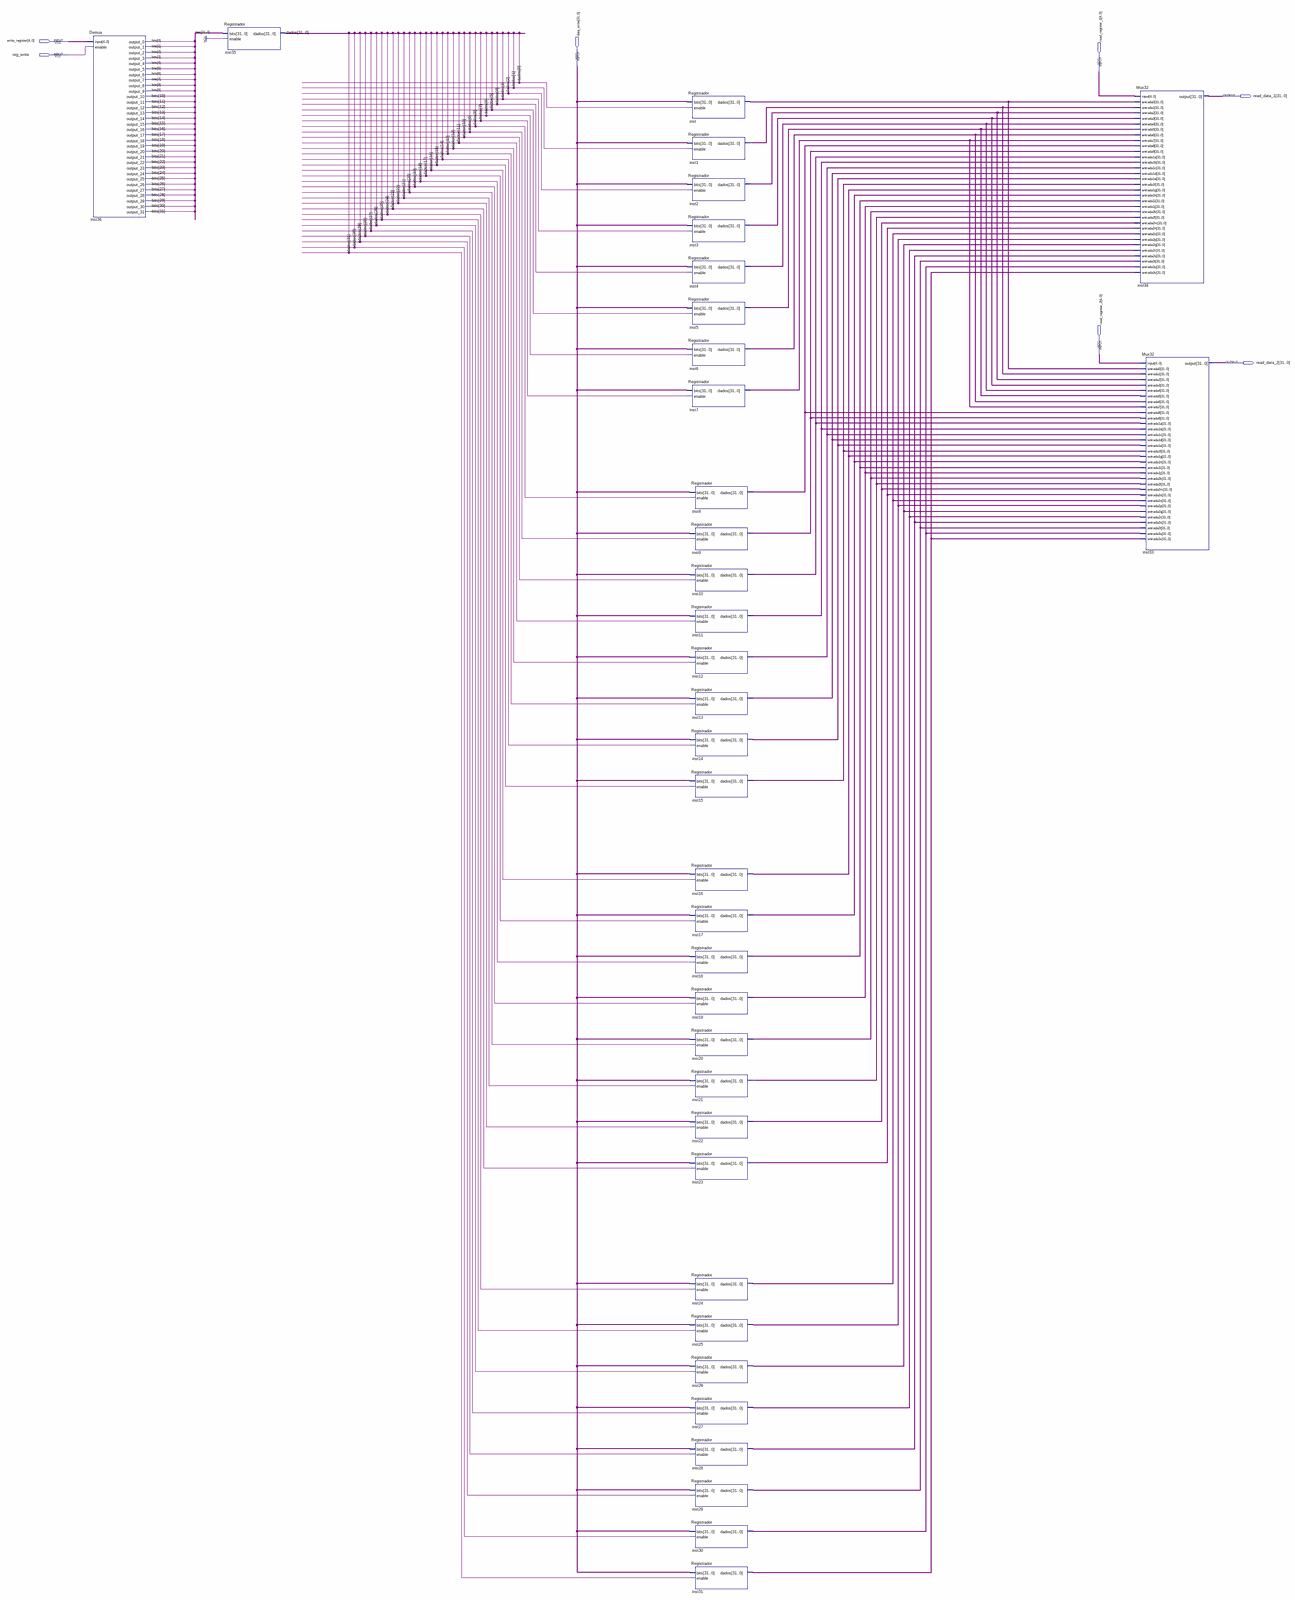
[diagram p0: schematic sheet, whole]
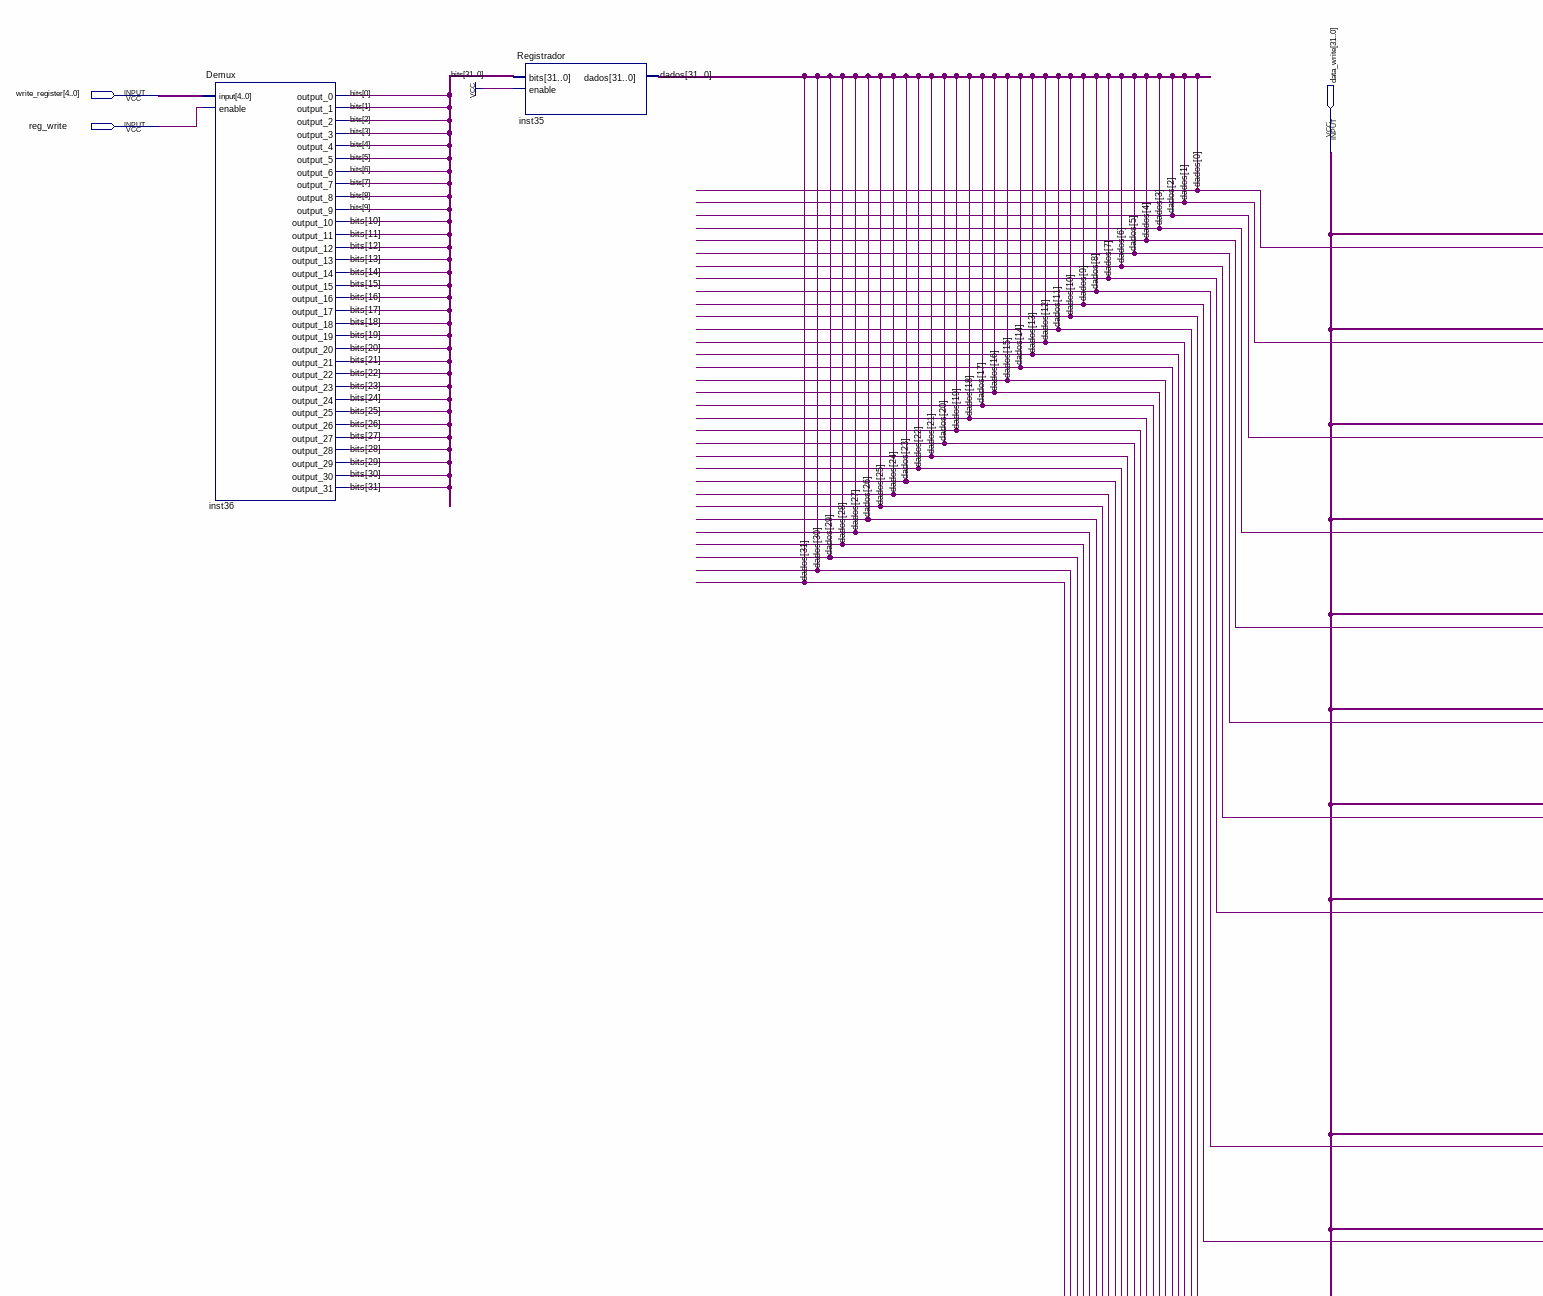
[diagram p1: schematic sheet, upper left part]
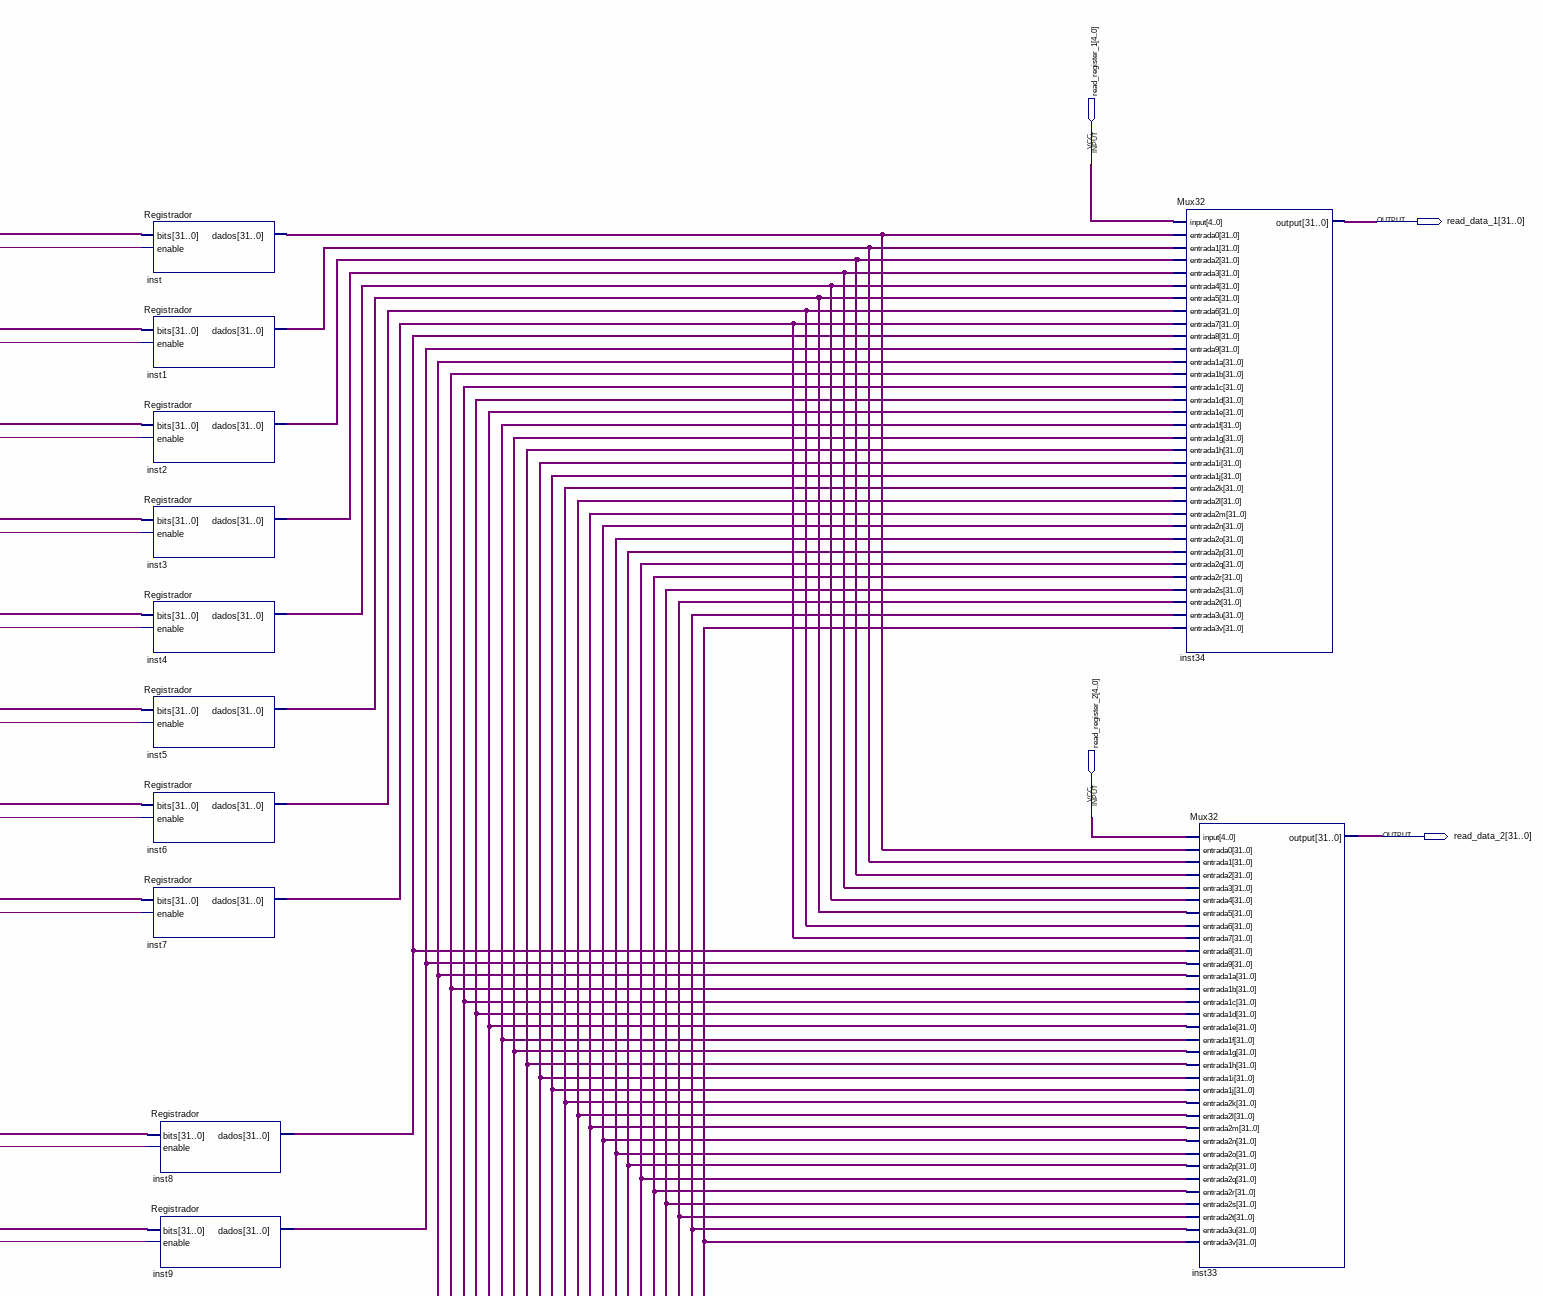
[diagram p2: schematic sheet, upper right part]
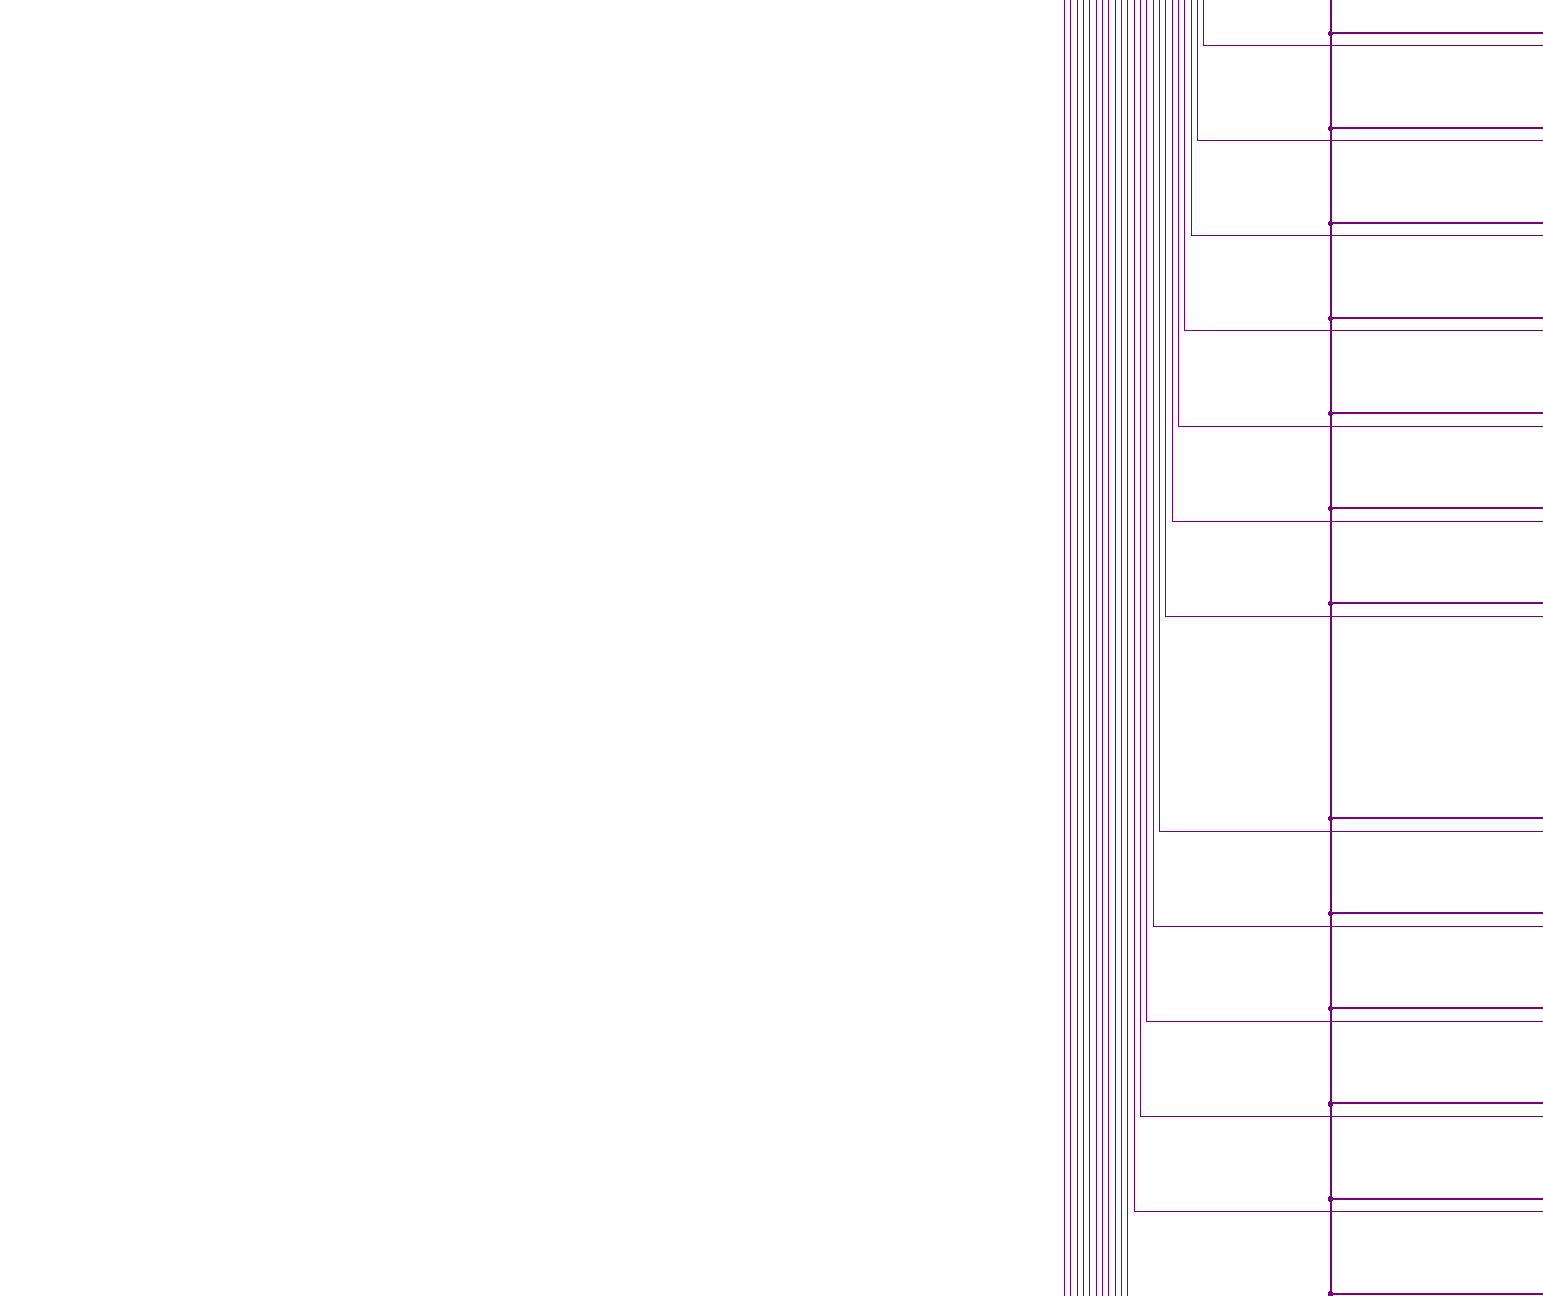
[diagram p3: schematic sheet, middle left part]
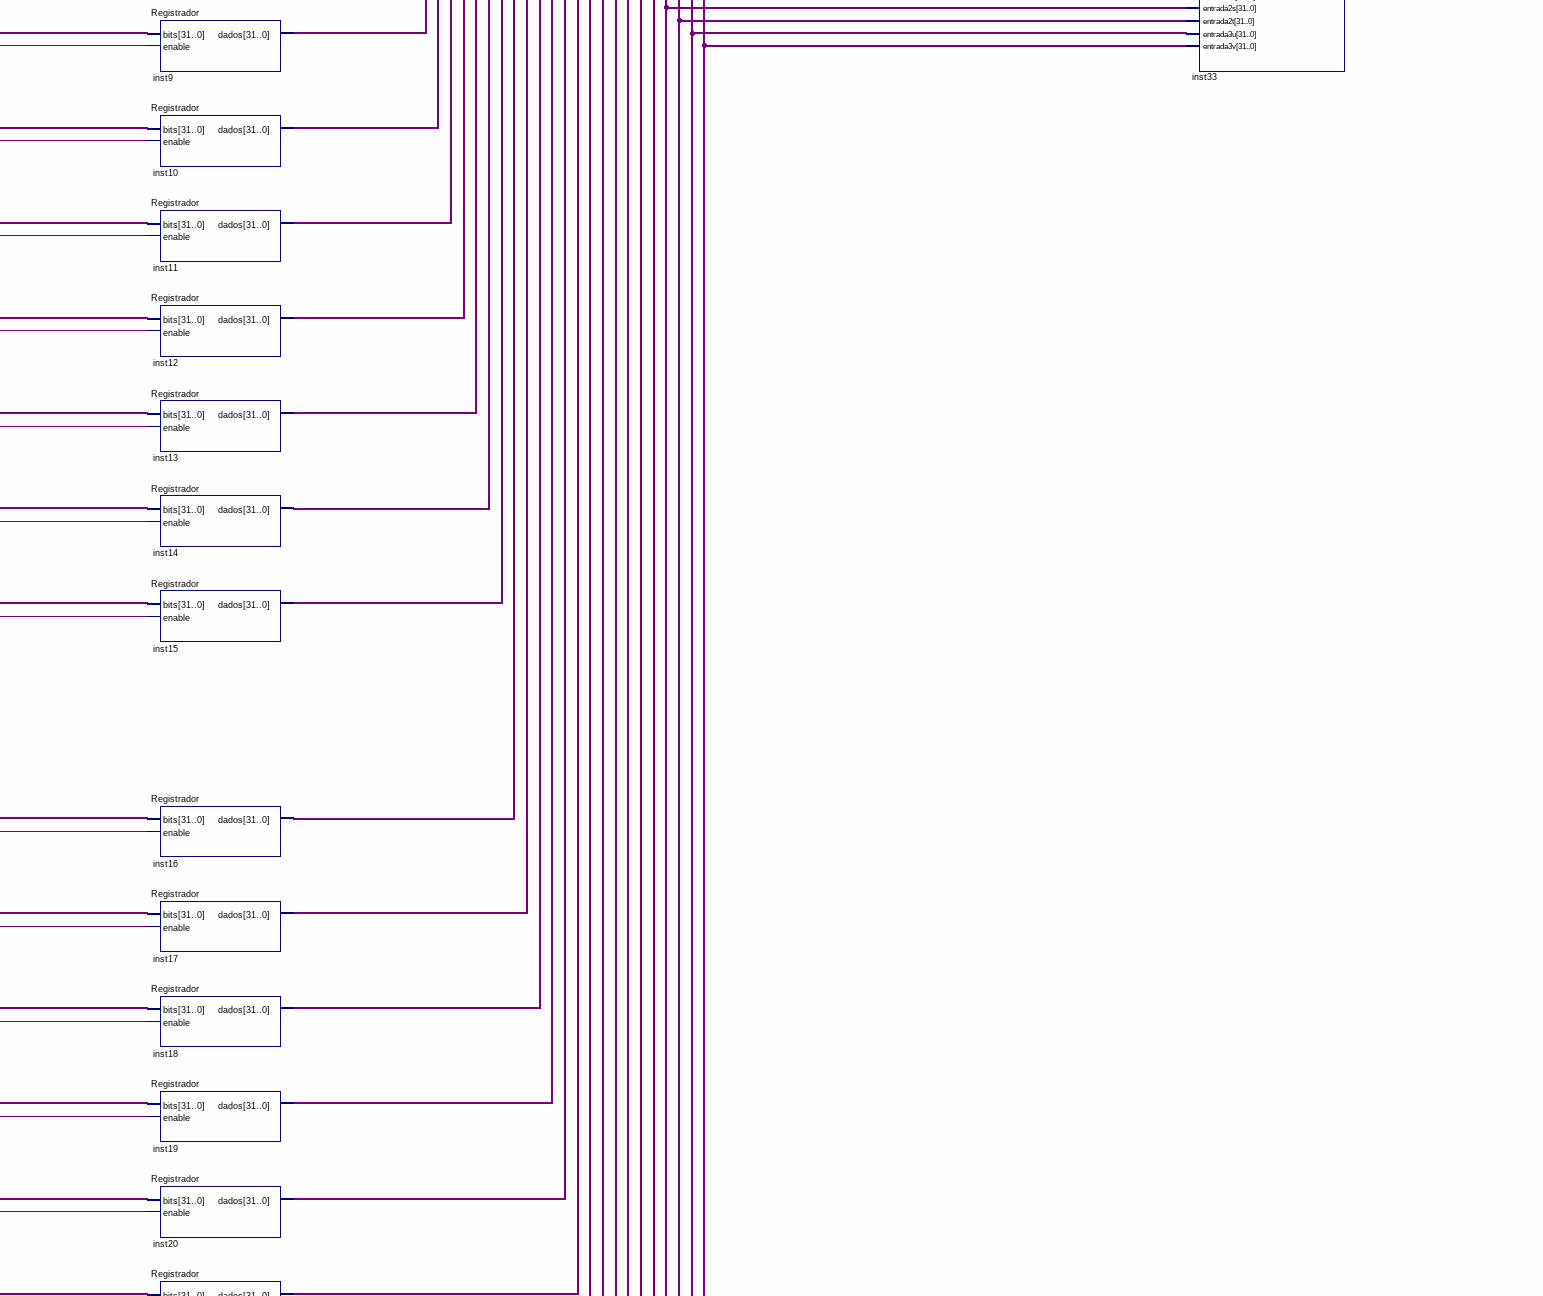
[diagram p4: schematic sheet, middle right part]
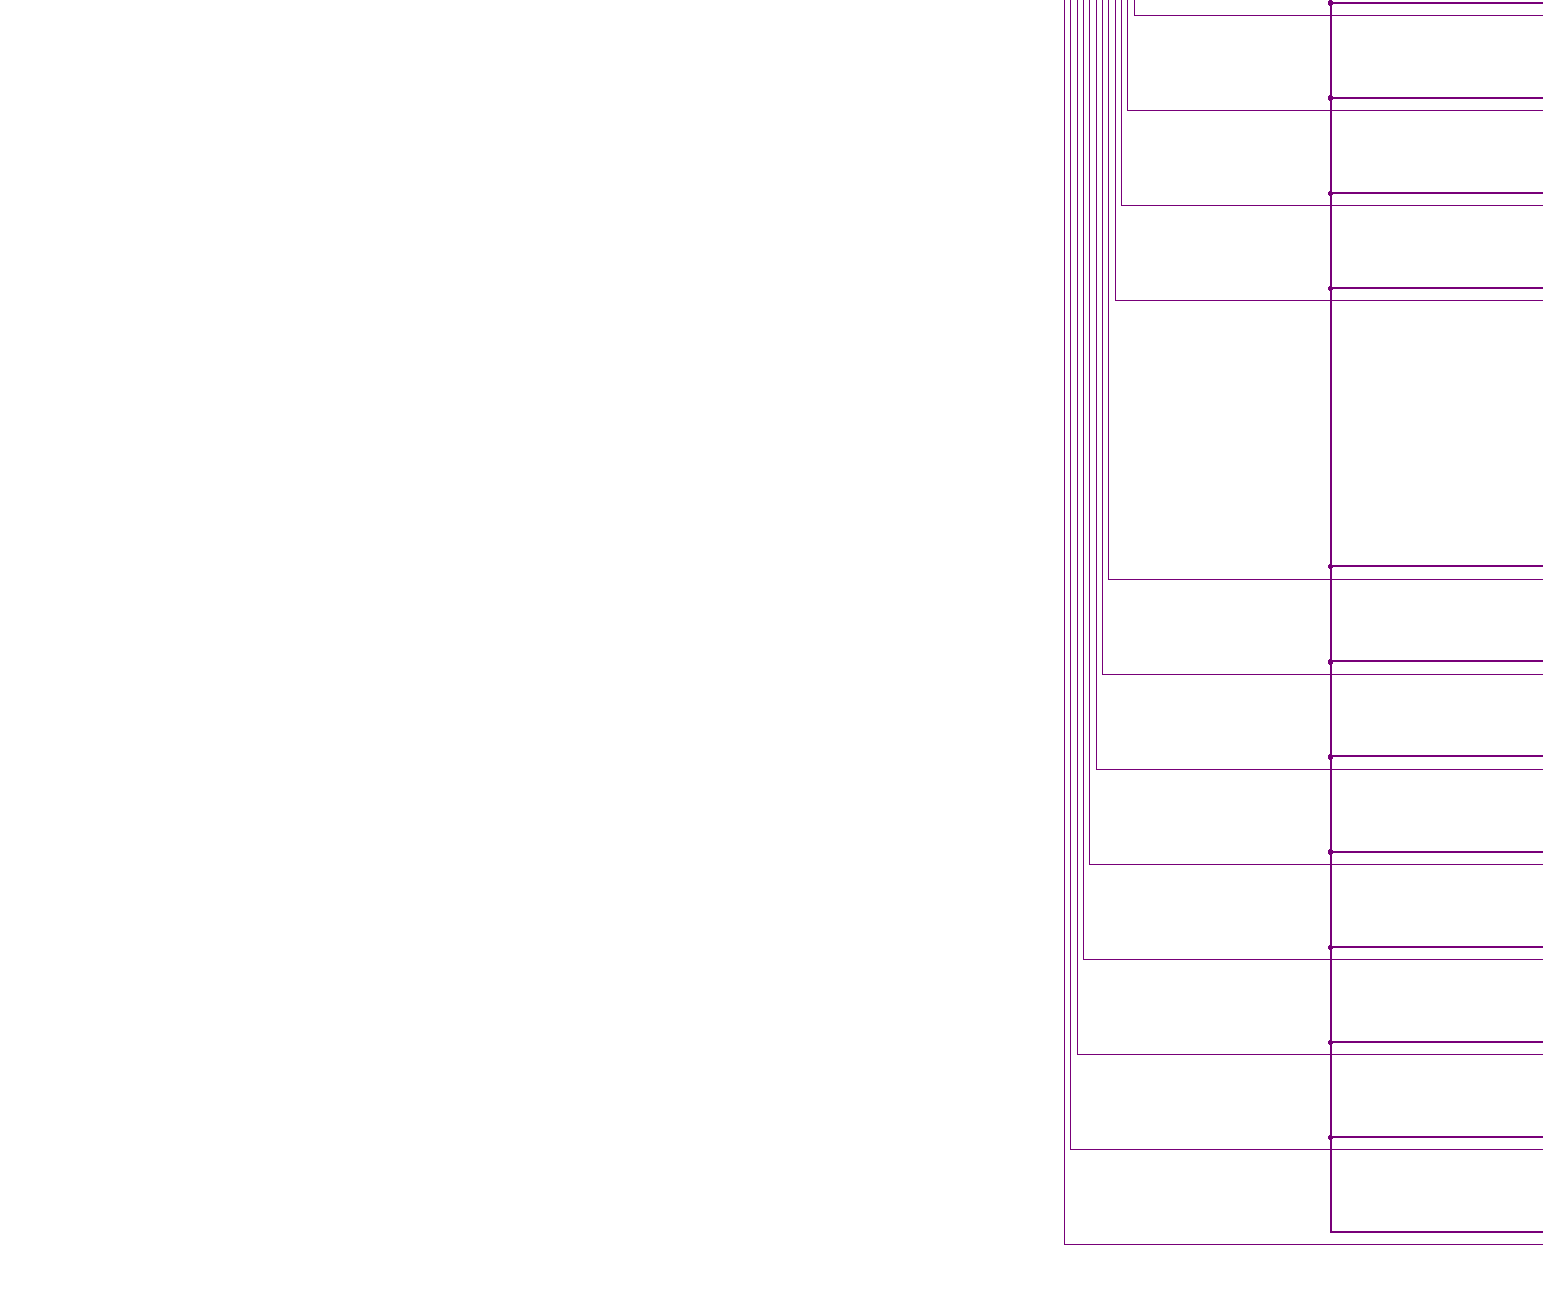
[diagram p5: schematic sheet, lower left part]
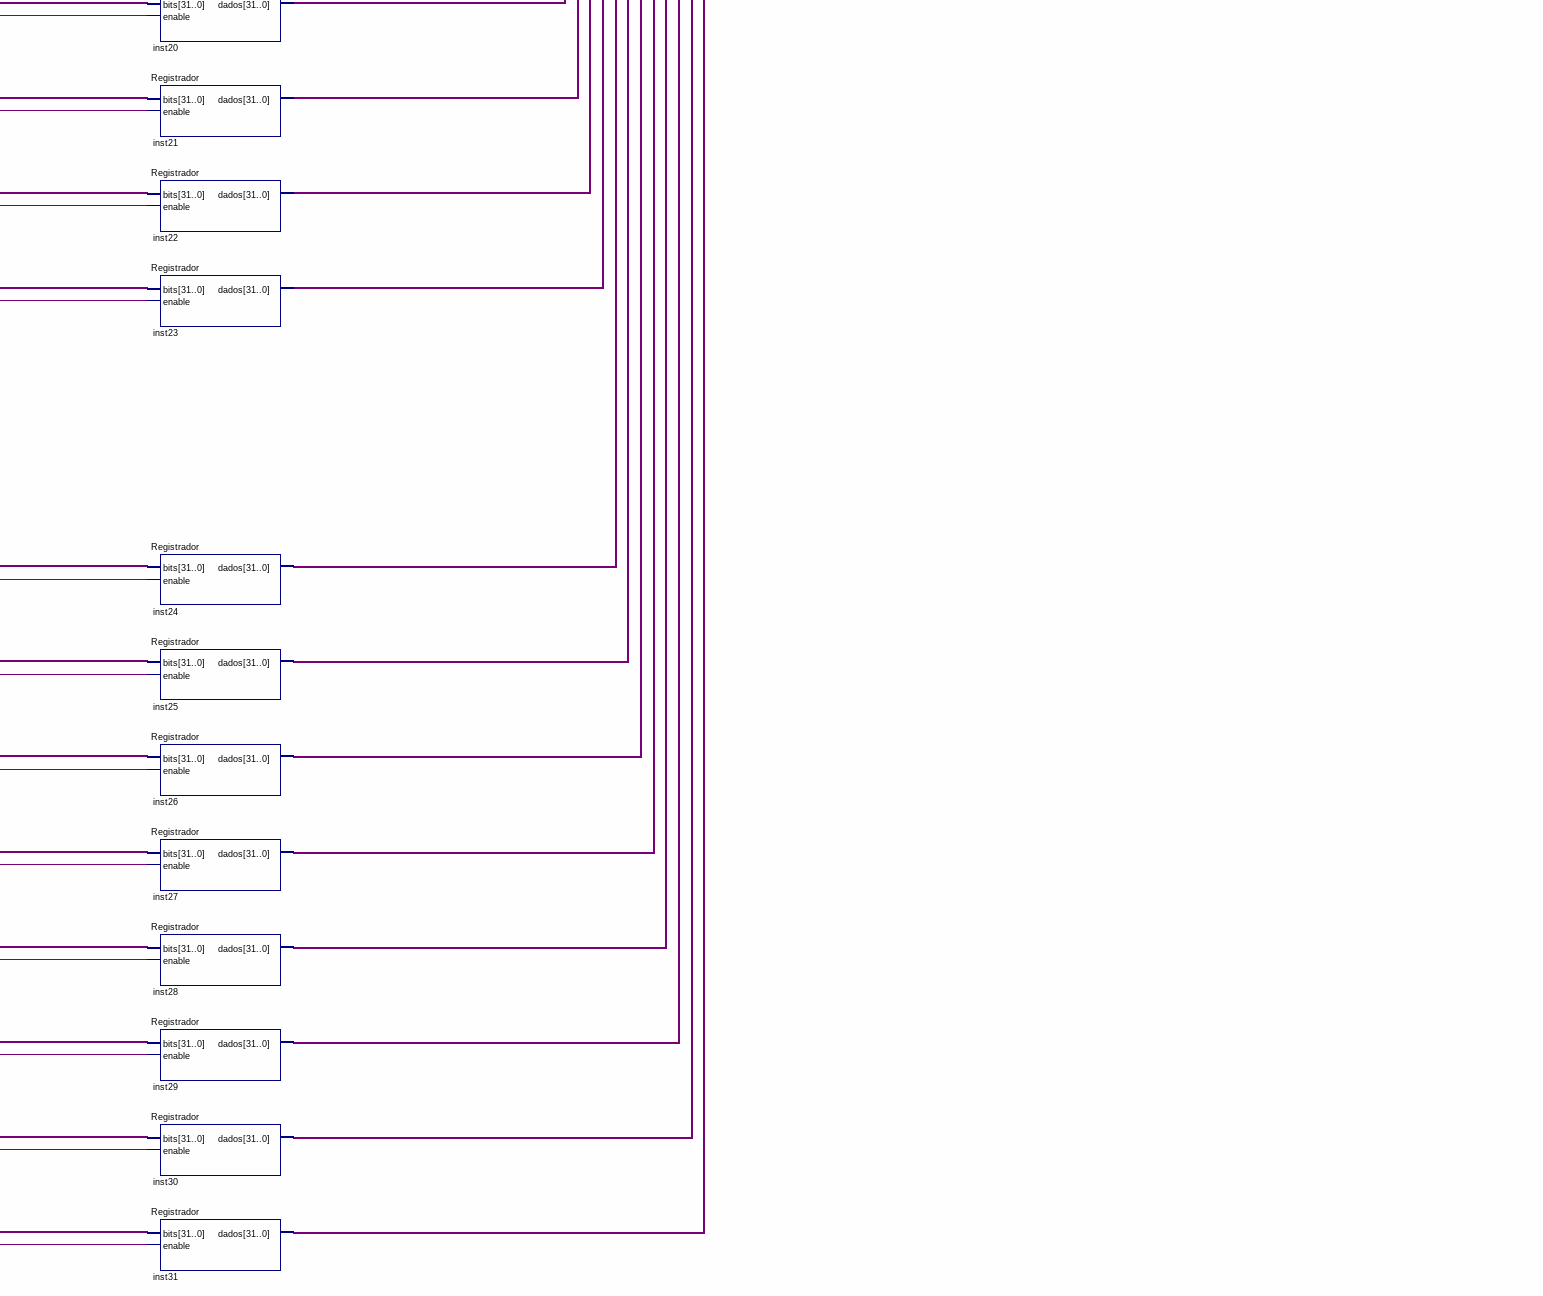
[diagram p6: schematic sheet, lower right part]
// Quartus schematic BancoRegistrador.bdf as structural Verilog: 36 symbols, 7 pins
module BancoRegistrador (
  input  [4:0] write_register,
  input  reg_write,
  input  [31:0] data_write,
  input  [4:0] read_register_1,
  input  [4:0] read_register_2,
  output [31:0] read_data_1,
  output [31:0] read_data_2
);

  wire [31:0] bits, dados, inst1_dados, inst2_dados, inst3_dados, inst4_dados, inst5_dados, inst6_dados,
       inst7_dados, inst8_dados, inst9_dados, inst10_dados, inst11_dados, inst12_dados, inst13_dados,
       inst14_dados, inst15_dados, inst16_dados, inst17_dados, inst18_dados, inst19_dados, inst20_dados,
       inst21_dados, inst22_dados, inst23_dados, inst24_dados, inst25_dados, inst26_dados, inst27_dados,
       inst28_dados, inst29_dados, inst30_dados, inst31_dados, inst_dados;

  Demux inst36 (
    .\input (write_register), .enable(reg_write), .output_0(bits[0]), .output_1(bits[1]), .output_2(bits[2]),
    .output_3(bits[3]), .output_4(bits[4]), .output_5(bits[5]), .output_6(bits[6]), .output_7(bits[7]),
    .output_8(bits[8]), .output_9(bits[9]), .output_10(bits[10]), .output_11(bits[11]), .output_12(bits[12]),
    .output_13(bits[13]), .output_14(bits[14]), .output_15(bits[15]), .output_16(bits[16]),
    .output_17(bits[17]), .output_18(bits[18]), .output_19(bits[19]), .output_20(bits[20]),
    .output_21(bits[21]), .output_22(bits[22]), .output_23(bits[23]), .output_24(bits[24]),
    .output_25(bits[25]), .output_26(bits[26]), .output_27(bits[27]), .output_28(bits[28]),
    .output_29(bits[29]), .output_30(bits[30]), .output_31(bits[31]));
  Registrador inst35 (.bits(bits), .enable(1'b1), .dados(dados));
  Registrador inst (.bits(data_write), .enable(dados[0]), .dados(inst_dados));
  Registrador inst1 (.bits(data_write), .enable(dados[1]), .dados(inst1_dados));
  Registrador inst2 (.bits(data_write), .enable(dados[2]), .dados(inst2_dados));
  Registrador inst3 (.bits(data_write), .enable(dados[3]), .dados(inst3_dados));
  Registrador inst4 (.bits(data_write), .enable(dados[4]), .dados(inst4_dados));
  Registrador inst5 (.bits(data_write), .enable(dados[5]), .dados(inst5_dados));
  Registrador inst6 (.bits(data_write), .enable(dados[6]), .dados(inst6_dados));
  Registrador inst7 (.bits(data_write), .enable(dados[7]), .dados(inst7_dados));
  Registrador inst8 (.bits(data_write), .enable(dados[8]), .dados(inst8_dados));
  Registrador inst9 (.bits(data_write), .enable(dados[9]), .dados(inst9_dados));
  Registrador inst10 (.bits(data_write), .enable(dados[10]), .dados(inst10_dados));
  Registrador inst11 (.bits(data_write), .enable(dados[11]), .dados(inst11_dados));
  Registrador inst12 (.bits(data_write), .enable(dados[12]), .dados(inst12_dados));
  Registrador inst13 (.bits(data_write), .enable(dados[13]), .dados(inst13_dados));
  Registrador inst14 (.bits(data_write), .enable(dados[14]), .dados(inst14_dados));
  Registrador inst15 (.bits(data_write), .enable(dados[15]), .dados(inst15_dados));
  Registrador inst16 (.bits(data_write), .enable(dados[16]), .dados(inst16_dados));
  Registrador inst17 (.bits(data_write), .enable(dados[17]), .dados(inst17_dados));
  Registrador inst18 (.bits(data_write), .enable(dados[18]), .dados(inst18_dados));
  Registrador inst19 (.bits(data_write), .enable(dados[19]), .dados(inst19_dados));
  Registrador inst20 (.bits(data_write), .enable(dados[20]), .dados(inst20_dados));
  Registrador inst21 (.bits(data_write), .enable(dados[21]), .dados(inst21_dados));
  Registrador inst22 (.bits(data_write), .enable(dados[22]), .dados(inst22_dados));
  Registrador inst23 (.bits(data_write), .enable(dados[23]), .dados(inst23_dados));
  Registrador inst24 (.bits(data_write), .enable(dados[24]), .dados(inst24_dados));
  Registrador inst25 (.bits(data_write), .enable(dados[25]), .dados(inst25_dados));
  Registrador inst26 (.bits(data_write), .enable(dados[26]), .dados(inst26_dados));
  Registrador inst27 (.bits(data_write), .enable(dados[27]), .dados(inst27_dados));
  Registrador inst28 (.bits(data_write), .enable(dados[28]), .dados(inst28_dados));
  Registrador inst29 (.bits(data_write), .enable(dados[29]), .dados(inst29_dados));
  Registrador inst30 (.bits(data_write), .enable(dados[30]), .dados(inst30_dados));
  Registrador inst31 (.bits(data_write), .enable(dados[31]), .dados(inst31_dados));
  Mux32 inst34 (
    .\input (read_register_1), .entrada0(inst_dados), .entrada1(inst1_dados), .entrada2(inst2_dados),
    .entrada3(inst3_dados), .entrada4(inst4_dados), .entrada5(inst5_dados), .entrada6(inst6_dados),
    .entrada7(inst7_dados), .entrada8(inst8_dados), .entrada9(inst9_dados), .entrada1a(inst10_dados),
    .entrada1b(inst11_dados), .entrada1c(inst12_dados), .entrada1d(inst13_dados), .entrada1e(inst14_dados),
    .entrada1f(inst15_dados), .entrada1g(inst16_dados), .entrada1h(inst17_dados), .entrada1i(inst18_dados),
    .entrada1j(inst19_dados), .entrada2k(inst20_dados), .entrada2l(inst21_dados), .entrada2m(inst22_dados),
    .entrada2n(inst23_dados), .entrada2o(inst24_dados), .entrada2p(inst25_dados), .entrada2q(inst26_dados),
    .entrada2r(inst27_dados), .entrada2s(inst28_dados), .entrada2t(inst29_dados), .entrada3u(inst30_dados),
    .entrada3v(inst31_dados), .\output (read_data_1));
  Mux32 inst33 (
    .\input (read_register_2), .entrada0(inst_dados), .entrada1(inst1_dados), .entrada2(inst2_dados),
    .entrada3(inst3_dados), .entrada4(inst4_dados), .entrada5(inst5_dados), .entrada6(inst6_dados),
    .entrada7(inst7_dados), .entrada8(inst8_dados), .entrada9(inst9_dados), .entrada1a(inst10_dados),
    .entrada1b(inst11_dados), .entrada1c(inst12_dados), .entrada1d(inst13_dados), .entrada1e(inst14_dados),
    .entrada1f(inst15_dados), .entrada1g(inst16_dados), .entrada1h(inst17_dados), .entrada1i(inst18_dados),
    .entrada1j(inst19_dados), .entrada2k(inst20_dados), .entrada2l(inst21_dados), .entrada2m(inst22_dados),
    .entrada2n(inst23_dados), .entrada2o(inst24_dados), .entrada2p(inst25_dados), .entrada2q(inst26_dados),
    .entrada2r(inst27_dados), .entrada2s(inst28_dados), .entrada2t(inst29_dados), .entrada3u(inst30_dados),
    .entrada3v(inst31_dados), .\output (read_data_2));
endmodule
